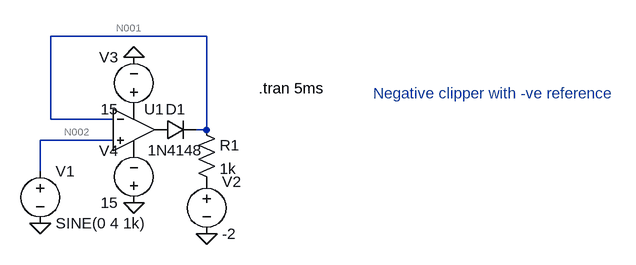
[diagram p0: schematic clipper.asc]
clipper.asc, the LTspice schematic file:
Version 4
SHEET 1 1032 680
WIRE 288 -16 48 -16
WIRE 48 112 48 -16
WIRE 144 112 48 112
WIRE 288 128 288 -16
WIRE 288 128 272 128
WIRE 144 144 32 144
WIRE 32 192 32 144
FLAG 288 288 0
FLAG 176 240 0
FLAG 32 272 0
FLAG 176 16 0
SYMBOL Opamps\\UniversalOpamp2 176 128 R0
SYMATTR InstName U1
SYMBOL voltage 32 176 R0
WINDOW 123 0 0 Left 0
WINDOW 39 0 0 Left 0
SYMATTR InstName V1
SYMATTR Value SINE(0 4 1k)
SYMBOL voltage 288 192 R0
WINDOW 123 0 0 Left 0
WINDOW 39 0 0 Left 0
SYMATTR InstName V2
SYMATTR Value -2
SYMBOL voltage 176 112 R180
WINDOW 0 24 96 Left 2
WINDOW 3 24 16 Left 2
WINDOW 123 0 0 Left 0
WINDOW 39 0 0 Left 0
SYMATTR InstName V3
SYMATTR Value 15
SYMBOL voltage 176 256 R180
WINDOW 0 24 96 Left 2
WINDOW 3 24 16 Left 2
WINDOW 123 0 0 Left 0
WINDOW 39 0 0 Left 0
SYMATTR InstName V4
SYMATTR Value 15
SYMBOL res 272 112 R0
SYMATTR InstName R1
SYMATTR Value 1k
SYMBOL diode 208 144 R270
WINDOW 0 32 32 VTop 2
WINDOW 3 0 32 VBottom 2
SYMATTR InstName D1
SYMATTR Value 1N4148
TEXT 368 64 Left 2 !.tran 5ms
TEXT 544 72 Left 2 ;Negative clipper with -ve reference

The netlist it stands for:
* clipper.asc
XU1 N002 N001 P001 P002 P003 level.2 Avol=1Meg GBW=10Meg Slew=10Meg ilimit=25m rail=0 Vos=0 phimargin=45 en=0 enk=0 in=0 ink=0 Rin=500Meg  ; pins IN+ IN- V+ V- OUT
V1 N002 0 SINE(0 4 1k)
V2 P004 0 -2
V3 P001 0 15
V4 0 P002 15
R1 N001 P004 1k
D1 P003 N001 1N4148
.model D D
.lib standard.dio
.tran 5ms
* Negative clipper with -ve reference
.lib UniversalOpamps2.sub
.backanno
.end

* Results of the author's LTspice run, read from the files saved beside the schematic
* Operating Point, zero values left out:
*   V(p003) = 616.7 mV
*   V(p001) = 15 V
*   V(p002) = -15 V
*   V(n001) = -632.1 nV
*   V(p004) = -2 V
*   I(D1) = 2 mA
*   I(R1) = 2 mA
*   I(V4) = -799 µA
*   I(V3) = -2.799 mA
*   I(V2) = 2 mA
*   Ix(u1:3) = 2.799 mA
*   Ix(u1:4) = -799 µA
*   Ix(u1:5) = -2 mA
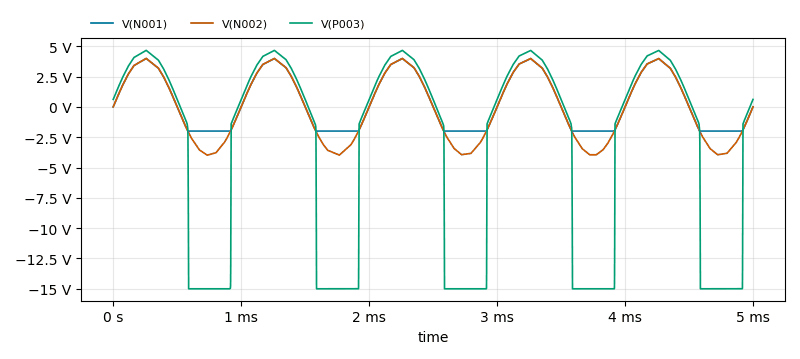
[diagram p1: Transient Analysis of clipper.asc, plotted from the saved traces]
* Transient Analysis, 1 run:
*   V(N001): min -2.007 V, max 3.991 V, average 413.3 mV, rms 2.333 V, last -407.8 µV
*   V(N002): min -3.983 V, max 3.992 V, average -8.167 mV, rms 2.792 V, last 0 V
*   V(P003): min -15 V, max 4.66 V, average -3.5 V, rms 8.979 V, last 616.3 mV